# Altium schematic sheet Digitizer.SchDoc
size A2
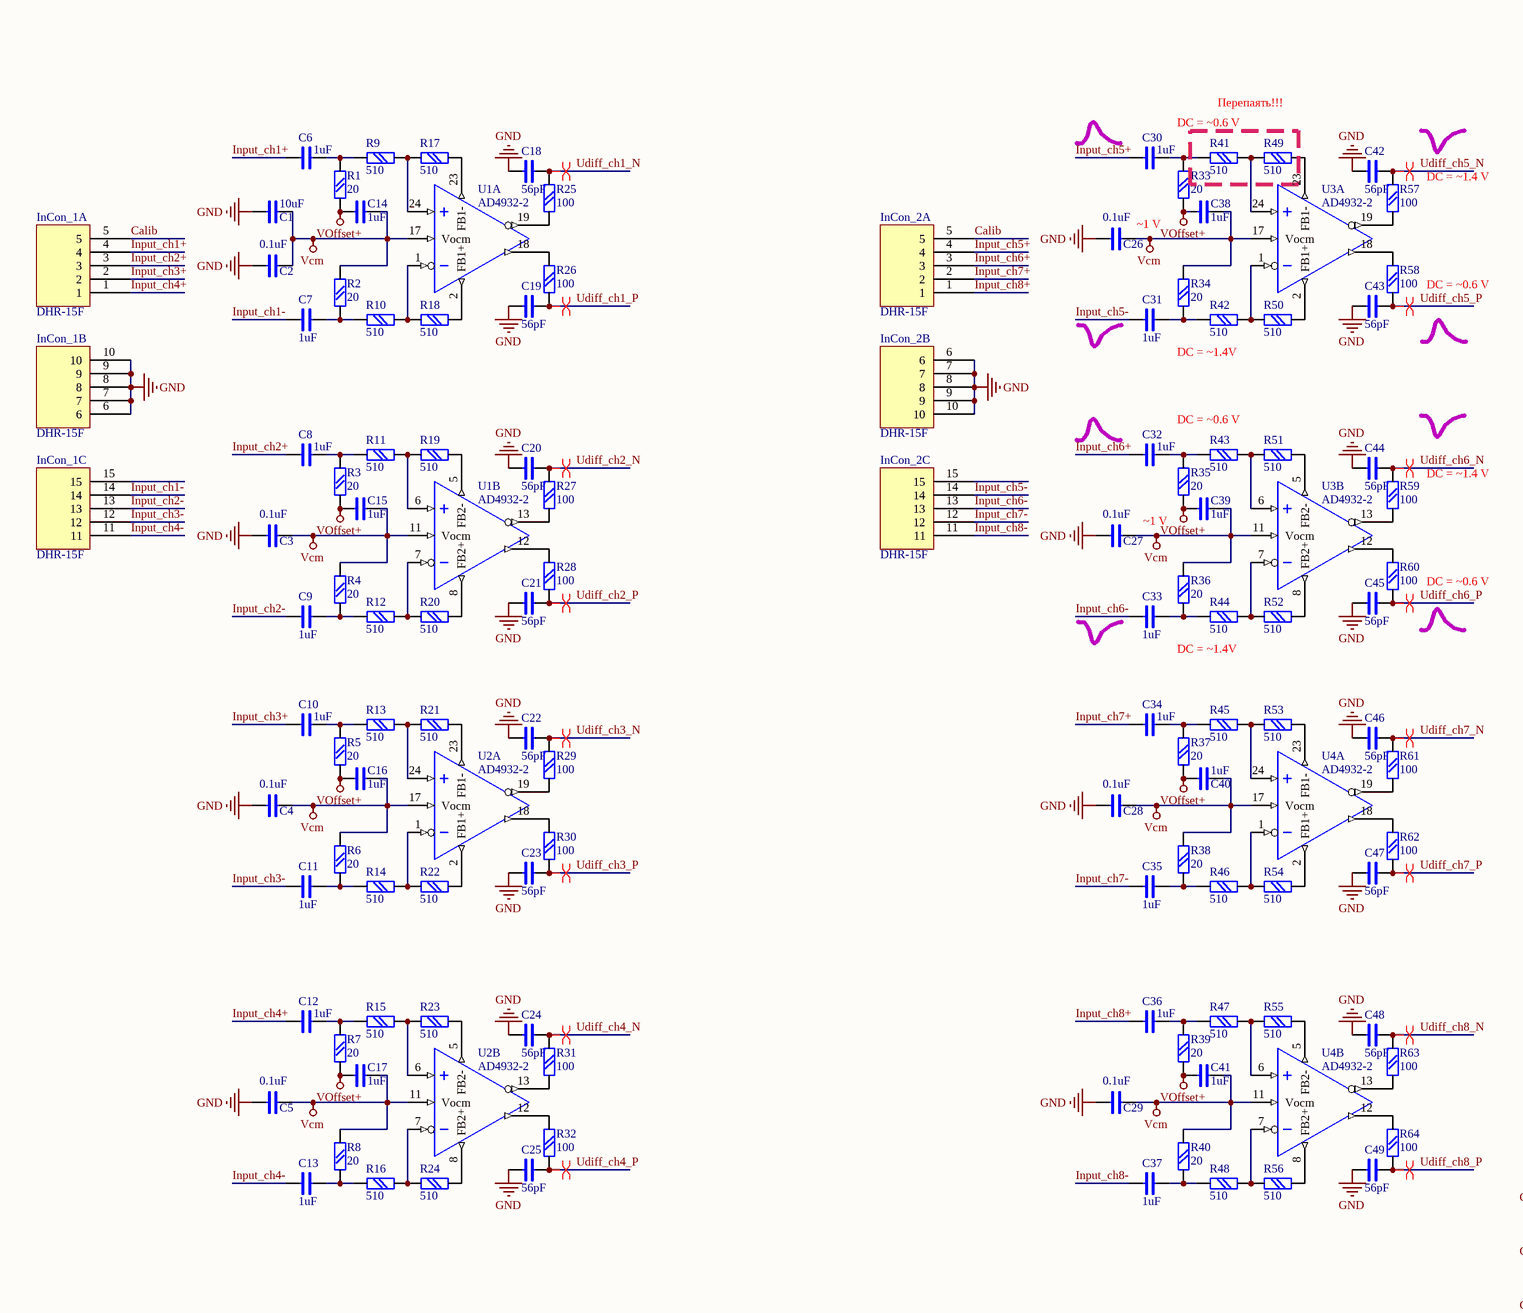
[diagram p0: Digitizer.SchDoc, left]
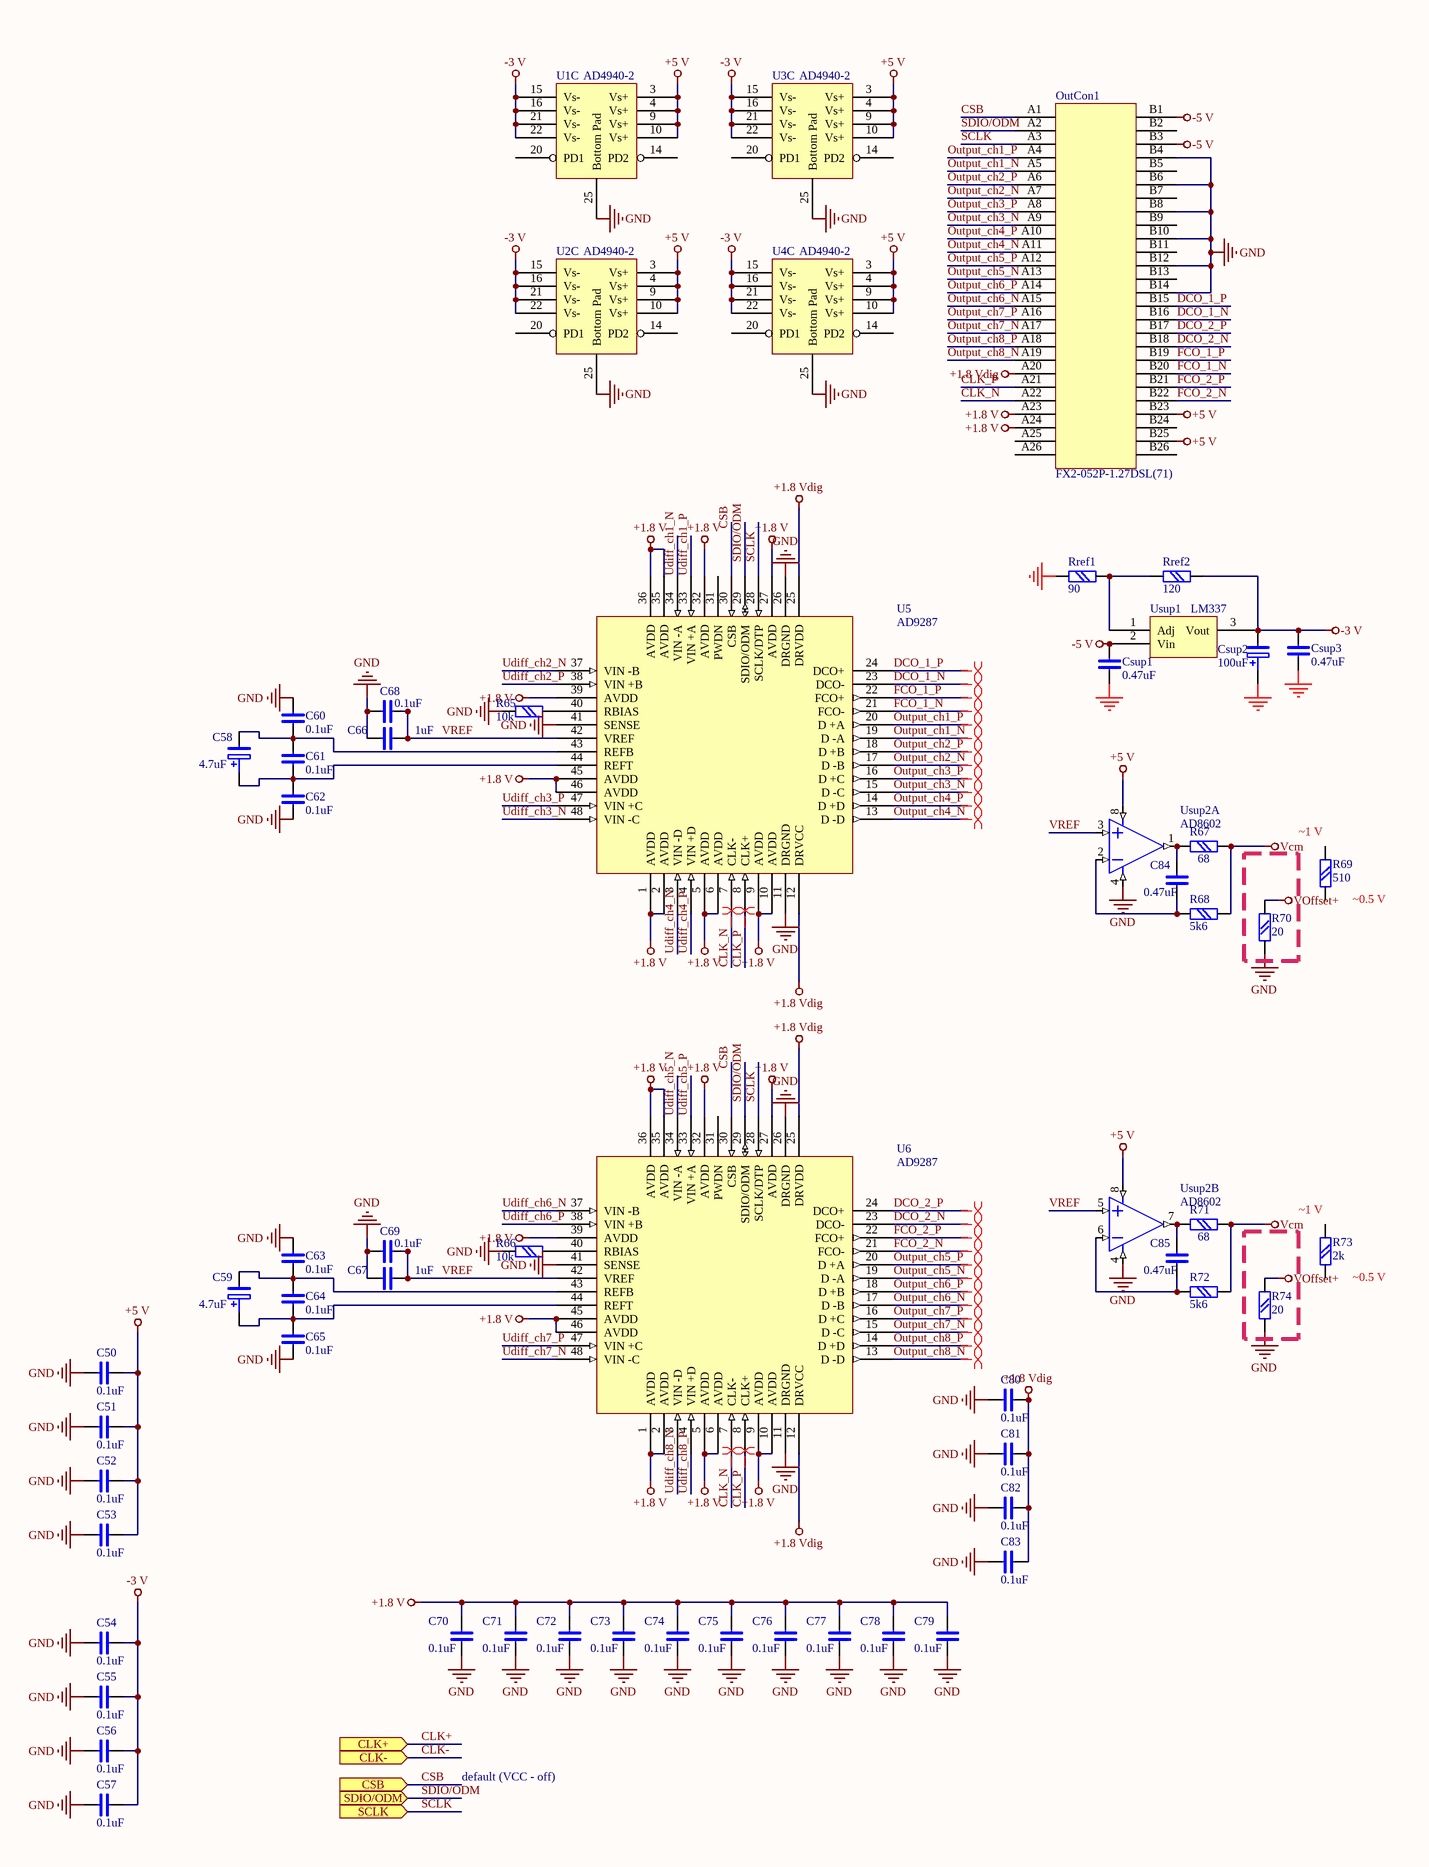
[diagram p1: Digitizer.SchDoc, right]

## Parts
C1  10uF  [chip1206]
C2  0.1uF  [chip0603]
C3  0.1uF  [chip0603]
C4  0.1uF  [chip0603]
C5  0.1uF  [chip0603]
C6  1uF  [chip0603]
C7  1uF  [chip0603]
C8  1uF  [chip0603]
C9  1uF  [chip0603]
C10  1uF  [chip0603]
C11  1uF  [chip0603]
C12  1uF  [chip0603]
C13  1uF  [chip0603]
C14  1uF  [chip0603]
C15  1uF  [chip0603]
C16  1uF  [chip0603]
C17  1uF  [chip0603]
C18  56pF  [chip0603]
C19  56pF  [chip0603]
C20  56pF  [chip0603]
C21  56pF  [chip0603]
C22  56pF  [chip0603]
C23  56pF  [chip0603]
C24  56pF  [chip0603]
C25  56pF  [chip0603]
C26  0.1uF  [chip0603]
C27  0.1uF  [chip0603]
C28  0.1uF  [chip0603]
C29  0.1uF  [chip0603]
C30  1uF  [chip0603]
C31  1uF  [chip0603]
C32  1uF  [chip0603]
C33  1uF  [chip0603]
C34  1uF  [chip0603]
C35  1uF  [chip0603]
C36  1uF  [chip0603]
C37  1uF  [chip0603]
C38  1uF  [chip0603]
C39  1uF  [chip0603]
C40  1uF  [chip0603]
C41  1uF  [chip0603]
C42  56pF  [chip0603]
C43  56pF  [chip0603]
C44  56pF  [chip0603]
C45  56pF  [chip0603]
C46  56pF  [chip0603]
C47  56pF  [chip0603]
C48  56pF  [chip0603]
C49  56pF  [chip0603]
C50  0.1uF  [chip0603]
C51  0.1uF  [chip0603]
C52  0.1uF  [chip0603]
C53  0.1uF  [chip0603]
C54  0.1uF  [chip0603]
C55  0.1uF  [chip0603]
C56  0.1uF  [chip0603]
C57  0.1uF  [chip0603]
C58  4.7uF  [chip1206]
C59  4.7uF  [CHIP1206]
C60  0.1uF  [chip0603]
C61  0.1uF  [chip0603]
C62  0.1uF  [chip0603]
C63  0.1uF  [chip0603]
C64  0.1uF  [chip0603]
C65  0.1uF  [chip0603]
C66  1uF  [chip0603]
C67  1uF  [chip0603]
C68  0.1uF  [chip0603]
C69  0.1uF  [chip0603]
C70  0.1uF  [chip0603]
C71  0.1uF  [chip0603]
C72  0.1uF  [chip0603]
C73  0.1uF  [chip0603]
C74  0.1uF  [chip0603]
C75  0.1uF  [chip0603]
C76  0.1uF  [chip0603]
C77  0.1uF  [chip0603]
C78  0.1uF  [chip0603]
C79  0.1uF  [chip0603]
C80  0.1uF  [chip0603]
C81  0.1uF  [chip0603]
C82  0.1uF  [chip0603]
C83  0.1uF  [chip0603]
C84  0.47uF  [chip0603]
C85  0.47uF  [chip0603]
Csup1  0.47uF  [chip0603]
Csup2  100uF  [CEL-SMD300]
Csup3  0.47uF  [chip0603]
InCon_1  DHR-15F  [DHR-F-15]  (parts A,B,C of 3)
InCon_2  DHR-15F  [DHR-F-15]  (parts A,B,C of 3)
OutCon1  FX2-052P-1.27DSL(71)  [FX2-52P-1.27DSL(71)]
R1  20  [chip0603]
R2  20  [chip0603]
R3  20  [chip0603]
R4  20  [chip0603]
R5  20  [chip0603]
R6  20  [chip0603]
R7  20  [chip0603]
R8  20  [chip0603]
R9  510  [chip0603]
R10  510  [chip0603]
R11  510  [chip0603]
R12  510  [chip0603]
R13  510  [chip0603]
R14  510  [chip0603]
R15  510  [chip0603]
R16  510  [chip0603]
R17  510  [chip0603]
R18  510  [chip0603]
R19  510  [chip0603]
R20  510  [chip0603]
R21  510  [chip0603]
R22  510  [chip0603]
R23  510  [chip0603]
R24  510  [chip0603]
R25  100  [chip0603]
R26  100  [chip0603]
R27  100  [chip0603]
R28  100  [chip0603]
R29  100  [chip0603]
R30  100  [chip0603]
R31  100  [chip0603]
R32  100  [chip0603]
R33  20  [chip0603]
R34  20  [chip0603]
R35  20  [chip0603]
R36  20  [chip0603]
R37  20  [chip0603]
R38  20  [chip0603]
R39  20  [chip0603]
R40  20  [chip0603]
R41  510  [chip0603]
R42  510  [chip0603]
R43  510  [chip0603]
R44  510  [chip0603]
R45  510  [chip0603]
R46  510  [chip0603]
R47  510  [chip0603]
R48  510  [chip0603]
R49  510  [chip0603]
R50  510  [chip0603]
R51  510  [chip0603]
R52  510  [chip0603]
R53  510  [chip0603]
R54  510  [chip0603]
R55  510  [chip0603]
R56  510  [chip0603]
R57  100  [chip0603]
R58  100  [chip0603]
R59  100  [chip0603]
R60  100  [chip0603]
R61  100  [chip0603]
R62  100  [chip0603]
R63  100  [chip0603]
R64  100  [chip0603]
R65  10k  [chip0603]
R66  10k  [chip0603]
R67  68  [chip0603]
R68  5k6  [chip0603]
R69  510  [chip0603]
R70  20  [chip0603]
R71  68  [chip0603]
R72  5k6  [chip0603]
R73  2k  [chip0603]
R74  20  [chip0603]
Rref1  90  [chip0603]
Rref2  120  [chip0603]
U1  AD4932-2  [CP-24-13]  (parts A,B,C of 3)
U2  AD4932-2  [CP-24-13]  (parts A,B,C of 3)
U3  AD4932-2  [CP-24-13]  (parts A,B,C of 3)
U4  AD4932-2  (parts A,B,C of 3)
U5  AD9287  [CP-48-8]
U6  AD9287  [CP-48-8]
Usup1  LM337  [SOT223_N]
Usup2  AD8602  [8SO200]  (parts A,B of 2)

## Blocks framed on the sheet
~1 V: R70
~1 V: R74

## Ports
CLK+ (in), CLK- (in), CSB (in), SCLK (in), SDIO/ODM (in)

## Nets
+1.8 V: C70.2 C71.2 C72.2 C73.2 C74.2 C75.2 C76.2 C77.2 C78.2 C79.2 OutCon1.A23 OutCon1.A24 U5.1(AVDD) U5.2(AVDD) U5.5(AVDD) U5.6(AVDD) U5.9(AVDD) U5.10(AVDD) U5.27(AVDD) U5.32(AVDD) U5.35(AVDD) U5.36(AVDD) U5.39(AVDD) U5.45(AVDD) U5.46(AVDD) U6.1(AVDD) U6.2(AVDD) U6.5(AVDD) U6.6(AVDD) U6.9(AVDD) U6.10(AVDD) U6.27(AVDD) U6.32(AVDD) U6.35(AVDD) U6.36(AVDD) U6.39(AVDD) U6.45(AVDD) U6.46(AVDD)
+1.8 Vdig: C80.2 C81.2 C82.2 C83.2 OutCon1.A20 U5.12(DRVCC) U5.25(DRVDD) U6.12(DRVCC) U6.25(DRVDD)
+5 V: C50.2 C51.2 C52.2 C53.2 OutCon1.B23 OutCon1.B25 U1.3(Vs+) U1.4(Vs+) U1.9(Vs+) U1.10(Vs+) U2.3(Vs+) U2.4(Vs+) U2.9(Vs+) U2.10(Vs+) U3.3(Vs+) U3.4(Vs+) U3.9(Vs+) U3.10(Vs+) U4.3(Vs+) U4.4(Vs+) U4.9(Vs+) U4.10(Vs+) Usup2.8(E+)
-3 V: C54.2 C55.2 C56.2 C57.2 Csup2.- Csup3.1 Rref2.1 U1.15(Vs-) U1.16(Vs-) U1.21(Vs-) U1.22(Vs-) U2.15(Vs-) U2.16(Vs-) U2.21(Vs-) U2.22(Vs-) U3.15(Vs-) U3.16(Vs-) U3.21(Vs-) U3.22(Vs-) U4.15(Vs-) U4.16(Vs-) U4.21(Vs-) U4.22(Vs-) Usup1.3(Vout)
-5 V: Csup1.1 OutCon1.B1 OutCon1.B3 Usup1.2(Vin)
AGND: U5.0(AGND) U6.0(AGND)
GND: C1.1 C2.1 C3.1 C4.1 C5.1 C18.2 C19.1 C20.2 C21.1 C22.2 C23.1 C24.2 C25.1 C26.1 C27.1 C28.1 C29.1 C42.2 C43.1 C44.2 C45.1 C46.2 C47.1 C48.2 C49.1 C50.1 C51.1 C52.1 C53.1 C54.1 C55.1 C56.1 C57.1 C60.2 C62.1 C63.2 C65.1 C66.1 C67.1 C68.1 C69.1 C70.1 C71.1 C72.1 C73.1 C74.1 C75.1 C76.1 C77.1 C78.1 C79.1 C80.1 C81.1 C82.1 C83.1 Csup1.2 Csup2.+ Csup3.2 InCon_1.6 InCon_1.7 InCon_1.8 InCon_1.9 InCon_1.10 InCon_2.6 InCon_2.7 InCon_2.8 InCon_2.9 InCon_2.10 OutCon1.B4 OutCon1.B6 OutCon1.B8 OutCon1.B10 OutCon1.B12 OutCon1.B14 R65.2 R66.2 R70.2 R74.2 Rref1.2 U1.25(Bottom_Pad) U2.25(Bottom_Pad) U3.25(Bottom_Pad) U4.25(Bottom_Pad) U5.11(DRGND) U5.26(DRGND) U5.41(SENSE) U6.11(DRGND) U6.26(DRGND) U6.41(SENSE) Usup2.4(E-)
Vcm: C1.2 C2.2 C3.2 C4.2 C5.2 C14.1 C15.1 C16.1 C17.1 C26.2 C27.2 C28.2 C29.2 C38.1 C39.1 C40.1 C41.1 R2.2 R4.2 R6.2 R8.2 R34.2 R36.2 R38.2 R40.2 R67.2 R68.2 R71.2 R72.2 U1.11(Vocm) U1.17(Vocm) U2.11(Vocm) U2.17(Vocm) U3.11(Vocm) U3.17(Vocm) U4.11(Vocm) U4.17(Vocm)
VOffset+: C14.2 C15.2 C16.2 C17.2 C38.2 C39.2 C40.2 C41.2 R1.1 R3.1 R5.1 R7.1 R33.1 R35.1 R37.1 R39.1 R70.1 R74.1
Calib: InCon_1.5 InCon_2.5
CLK+: port CLK+
CLK-: port CLK-
CLK_N: OutCon1.A22 U5.7(CLK-) U6.7(CLK-)
CLK_P: OutCon1.A21 U5.8(CLK+) U6.8(CLK+)
CSB: OutCon1.A1 U5.30(CSB) U6.30(CSB) ; port CSB
DCO_1_N: OutCon1.B16 U5.23(DCO-)
DCO_1_P: OutCon1.B15 U5.24(DCO+)
DCO_2_N: OutCon1.B18 U6.23(DCO-)
DCO_2_P: OutCon1.B17 U6.24(DCO+)
FCO_1_N: OutCon1.B20 U5.21(FCO-)
FCO_1_P: OutCon1.B19 U5.22(FCO+)
FCO_2_N: OutCon1.B22 U6.21(FCO-)
FCO_2_P: OutCon1.B21 U6.22(FCO+)
Input_ch1+: C6.1 InCon_1.4
Input_ch1-: C7.1 InCon_1.14
Input_ch2+: C8.1 InCon_1.3
Input_ch2-: C9.1 InCon_1.13
Input_ch3+: C10.1 InCon_1.2
Input_ch3-: C11.1 InCon_1.12
Input_ch4+: C12.1 InCon_1.1
Input_ch4-: C13.1 InCon_1.11
Input_ch5+: C30.1 InCon_2.4
Input_ch5-: C31.1 InCon_2.14
Input_ch6+: C32.1 InCon_2.3
Input_ch6-: C33.1 InCon_2.13
Input_ch7+: C34.1 InCon_2.2
Input_ch7-: C35.1 InCon_2.12
Input_ch8+: C36.1 InCon_2.1
Input_ch8-: C37.1 InCon_2.11
Output_ch1_N: OutCon1.A5 U5.19(D_-A)
Output_ch1_P: OutCon1.A4 U5.20(D_+A)
Output_ch2_N: OutCon1.A7 U5.17(D_-B)
Output_ch2_P: OutCon1.A6 U5.18(D_+B)
Output_ch3_N: OutCon1.A9 U5.15(D_-C)
Output_ch3_P: OutCon1.A8 U5.16(D_+C)
Output_ch4_N: OutCon1.A11 U5.13(D_-D)
Output_ch4_P: OutCon1.A10 U5.14(D_+D)
Output_ch5_N: OutCon1.A13 U6.19(D_-A)
Output_ch5_P: OutCon1.A12 U6.20(D_+A)
Output_ch6_N: OutCon1.A15 U6.17(D_-B)
Output_ch6_P: OutCon1.A14 U6.18(D_+B)
Output_ch7_N: OutCon1.A17 U6.15(D_-C)
Output_ch7_P: OutCon1.A16 U6.16(D_+C)
Output_ch8_N: OutCon1.A19 U6.13(D_-D)
Output_ch8_P: OutCon1.A18 U6.14(D_+D)
SCLK: OutCon1.A3 U5.28(SCLK/DTP) U6.28(SCLK/DTP) ; port SCLK
SDIO/ODM: OutCon1.A2 U5.29(SDIO/ODM) U6.29(SDIO/ODM) ; port SDIO/ODM
Udiff_ch1_N: C18.1 R25.2 U5.34(VIN_-A)
Udiff_ch1_P: C19.2 R26.2 U5.33(VIN_+A)
Udiff_ch2_N: C20.1 R27.2 U5.37(VIN_-B)
Udiff_ch2_P: C21.2 R28.2 U5.38(VIN_+B)
Udiff_ch3_N: C22.1 R29.2 U5.48(VIN_-C)
Udiff_ch3_P: C23.2 R30.2 U5.47(VIN_+C)
Udiff_ch4_N: C24.1 R31.2 U5.3(VIN_-D)
Udiff_ch4_P: C25.2 R32.2 U5.4(VIN_+D)
Udiff_ch5_N: C42.1 R57.2 U6.34(VIN_-A)
Udiff_ch5_P: C43.2 R58.2 U6.33(VIN_+A)
Udiff_ch6_N: C44.1 R59.2 U6.37(VIN_-B)
Udiff_ch6_P: C45.2 R60.2 U6.38(VIN_+B)
Udiff_ch7_N: C46.1 R61.2 U6.48(VIN_-C)
Udiff_ch7_P: C47.2 R62.2 U6.47(VIN_+C)
Udiff_ch8_N: C48.1 R63.2 U6.3(VIN_-D)
Udiff_ch8_P: C49.2 R64.2 U6.4(VIN_+D)
VREF: C66.2 C67.2 C68.2 C69.2 U5.42(VREF) U6.42(VREF) Usup2.3(+IN) Usup2.5(+IN)
NetC6_2: C6.2 R1.2 R9.2
NetC7_2: C7.2 R2.1 R10.2
NetC8_2: C8.2 R3.2 R11.2
NetC9_2: C9.2 R4.1 R12.2
NetC10_2: C10.2 R5.2 R13.2
NetC11_2: C11.2 R6.1 R14.2
NetC12_2: C12.2 R7.2 R15.2
NetC13_2: C13.2 R8.1 R16.2
NetC30_2: C30.2 R33.2 R41.2
NetC31_2: C31.2 R34.1 R42.2
NetC32_2: C32.2 R35.2 R43.2
NetC33_2: C33.2 R36.1 R44.2
NetC34_2: C34.2 R37.2 R45.2
NetC35_2: C35.2 R38.1 R46.2
NetC36_2: C36.2 R39.2 R47.2
NetC37_2: C37.2 R40.1 R48.2
NetC58_+: C58.+ C61.1 C62.2 U5.44(REFT)
NetC58_-: C58.- C60.1 C61.2 U5.43(REFB)
NetC59_+: C59.+ C64.1 C65.2 U6.44(REFT)
NetC59_-: C59.- C63.1 C64.2 U6.43(REFB)
NetC84_1: C84.1 R67.1 Usup2.1(OUT)
NetC84_2: C84.2 R68.1 Usup2.2(-IN)
NetC85_1: C85.1 R71.1 Usup2.7(OUT)
NetC85_2: C85.2 R72.1 Usup2.6(-IN)
NetR9_1: R9.1 R17.1 U1.24(In+)
NetR10_1: R10.1 R18.2 U1.1(In-)
NetR11_1: R11.1 R19.1 U1.6(In+)
NetR12_1: R12.1 R20.2 U1.7(In-)
NetR13_1: R13.1 R21.1 U2.24(In+)
NetR14_1: R14.1 R22.2 U2.1(In-)
NetR15_1: R15.1 R23.1 U2.6(In+)
NetR16_1: R16.1 R24.2 U2.7(In-)
NetR17_2: R17.2 U1.23(FB1-)
NetR18_1: R18.1 U1.2(FB1+)
NetR19_2: R19.2 U1.5(FB2-)
NetR20_1: R20.1 U1.8(FB2+)
NetR21_2: R21.2 U2.23(FB1-)
NetR22_1: R22.1 U2.2(FB1+)
NetR23_2: R23.2 U2.5(FB2-)
NetR24_1: R24.1 U2.8(FB2+)
NetR25_1: R25.1 U1.19(Out-)
NetR26_1: R26.1 U1.18(Out+)
NetR27_1: R27.1 U1.13(Out-)
NetR28_1: R28.1 U1.12(Out+)
NetR29_1: R29.1 U2.19(Out-)
NetR30_1: R30.1 U2.18(Out+)
NetR31_1: R31.1 U2.13(Out-)
NetR32_1: R32.1 U2.12(Out+)
NetR41_1: R41.1 R49.1 U3.24(In+)
NetR42_1: R42.1 R50.2 U3.1(In-)
NetR43_1: R43.1 R51.1 U3.6(In+)
NetR44_1: R44.1 R52.2 U3.7(In-)
NetR45_1: R45.1 R53.1 U4.24(In+)
NetR46_1: R46.1 R54.2 U4.1(In-)
NetR47_1: R47.1 R55.1 U4.6(In+)
NetR48_1: R48.1 R56.2 U4.7(In-)
NetR49_2: R49.2 U3.23(FB1-)
NetR50_1: R50.1 U3.2(FB1+)
NetR51_2: R51.2 U3.5(FB2-)
NetR52_1: R52.1 U3.8(FB2+)
NetR53_2: R53.2 U4.23(FB1-)
NetR54_1: R54.1 U4.2(FB1+)
NetR55_2: R55.2 U4.5(FB2-)
NetR56_1: R56.1 U4.8(FB2+)
NetR57_1: R57.1 U3.19(Out-)
NetR58_1: R58.1 U3.18(Out+)
NetR59_1: R59.1 U3.13(Out-)
NetR60_1: R60.1 U3.12(Out+)
NetR61_1: R61.1 U4.19(Out-)
NetR62_1: R62.1 U4.18(Out+)
NetR63_1: R63.1 U4.13(Out-)
NetR64_1: R64.1 U4.12(Out+)
NetR65_1: R65.1 U5.40(RBIAS)
NetR66_1: R66.1 U6.40(RBIAS)
NetRref1_1: Rref1.1 Rref2.2 Usup1.1(Adj)

Not connected (* = marked no-connect by the designer): InCon_1 15; InCon_2 15; OutCon1 A25 A26 B2(2) B5(5) B7(7) B9(9) B11(11) B13(13) B24 B26; R69 1 2; R73 1 2; U1 14(PD2) 20(PD1); U2 14(PD2) 20(PD1); U3 14(PD2) 20(PD1); U4 14(PD2) 20(PD1); U5 31(PWDN); U6 31(PWDN)

## Layout directives
differential pair: CLK_N, CLK_P, DCO_1_N, DCO_1_P, DCO_2_N, DCO_2_P, FCO_1_N, FCO_1_P, FCO_2_N, FCO_2_P, Output_ch1_N, Output_ch1_P, Output_ch2_N, Output_ch2_P, Output_ch3_N, Output_ch3_P, Output_ch4_N, Output_ch4_P, Output_ch5_N, Output_ch5_P, Output_ch6_N, Output_ch6_P, Output_ch7_N, Output_ch7_P, Output_ch8_N, Output_ch8_P, Udiff_ch1_N, Udiff_ch1_P, Udiff_ch2_N, Udiff_ch2_P, Udiff_ch3_N, Udiff_ch3_P, Udiff_ch4_N, Udiff_ch4_P, Udiff_ch5_N, Udiff_ch5_P, Udiff_ch6_N, Udiff_ch6_P, Udiff_ch7_N, Udiff_ch7_P, Udiff_ch8_N, Udiff_ch8_P

## Notes on the sheet
- Перепаять!!!
- DC = ~0.6 V
- DC = ~1.4 V
- (near C26) ~1 V
- DC = ~1.4V
- ~1 V
- (near R69) ~0.5 V
- (near R73) ~0.5 V
- default (VCC - off)

## Library data of the parts
C1-C57 C60-C85 Csup1 Csup3 = C: Text Field1: 20; Text Field2: 10
C58 C59 Csup2 = C POL: Text Field1: 20; Text Field2: 20
R1-R8 R33-R40 R70 R74 = R: Text Field1: 20; Text Field2: 20
R9-R32 R41-R69 R71-R73 = R: Text Field1: 20; Text Field2: 20
Rref1 Rref2 = MLT: Text Field1: 20; Text Field2: 20
Usup1 = LM337: 3-Terminal Adjustable Negative Regulators
Usup2 = KR1040UD1: Text Field1: 40; Text Field2: 40